# Altium project Altium git.PrjPcb
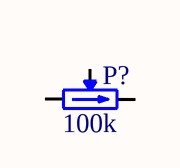
[diagram p0: Sheet1.SchDoc]
1 sheet, 1 parts. Net scope: global (net labels, ports and power ports of the same name join across sheets).
Board file: PCB1.PcbDoc

## Sheet Sheet1.SchDoc
size A; SheetNumber: 1; SheetTotal: 1

### Parts
P?  100k  [TRIM_BOURNS_3223W]

### Nets

Not connected (* = marked no-connect by the designer): P? 1(CCW) 2(W) 3(CW)

### Library data of the parts
P? = TRIM_11T_100K_BOURNS_3223W-1-104E: Trimming Potentiometer; Part Description: 11 Turns SMD Trimpot® Trimming Potentiometer (Top Adjust); Manufacturer: BOURNS; Power: 0.125W; TC: ±100ppm/°C; Tolerance: ±20%; PressFit: No; Part Number: TRIM_11T_100K_BOURNS_3223W-1-104E; Component Kind: Standard; Component Type: Standard; Pin Count: 3; Value: 100k; Manufacturer Part Number: 3223W-1-104E; Case: 3223W; Mounted: Yes; Socket: No; SMD: Yes; Sense: No; ComponentHeight: 4.16mm; HelpURL: \\cern.ch\dfs\Applications\Altium\Datasheets\TRIM_BOURNS_3223W.pdf; Author: CERN DEM JLC; CreateDate: 31-Mar-11; LatestRevisionDate: 18-Dec-12